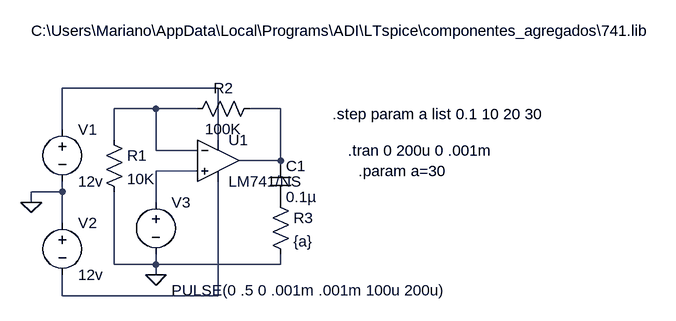
[diagram p0: schematic ej6_g2_C_sim.asc]
ej6_g2_C_sim.asc, the LTspice schematic file:
Version 4
SHEET 1 1064 680
WIRE 272 144 32 144
WIRE 176 176 112 176
WIRE 240 176 176 176
WIRE 368 176 320 176
WIRE 32 208 32 144
WIRE 112 224 112 176
WIRE 272 224 272 144
WIRE 176 240 176 176
WIRE 240 240 176 240
WIRE 368 256 368 176
WIRE 368 256 304 256
WIRE 240 272 176 272
WIRE 32 304 32 288
WIRE 32 304 -16 304
WIRE -16 320 -16 304
WIRE 176 320 176 272
WIRE 32 352 32 304
WIRE 112 416 112 304
WIRE 176 416 176 400
WIRE 176 416 112 416
WIRE 368 416 368 400
WIRE 368 416 176 416
WIRE 176 432 176 416
WIRE 32 464 32 432
WIRE 272 464 272 288
WIRE 272 464 32 464
FLAG -16 320 0
FLAG 176 432 0
SYMBOL res 96 208 R0
SYMATTR InstName R1
SYMATTR Value 10K
SYMBOL res 336 160 R90
WINDOW 0 0 56 VBottom 2
WINDOW 3 32 56 VTop 2
SYMATTR InstName R2
SYMATTR Value 100K
SYMBOL cap 352 256 R0
SYMATTR InstName C1
SYMATTR Value 0.1µ
SYMBOL voltage 32 192 R0
WINDOW 123 0 0 Left 0
WINDOW 39 0 0 Left 0
SYMATTR InstName V1
SYMATTR Value 12v
SYMBOL voltage 32 336 R0
WINDOW 123 0 0 Left 0
WINDOW 39 0 0 Left 0
SYMATTR InstName V2
SYMATTR Value 12v
SYMBOL voltage 176 304 R0
WINDOW 3 24 152 Left 2
WINDOW 123 24 124 Left 2
WINDOW 39 0 0 Left 0
SYMATTR Value PULSE(0 .5 0 .001m .001m 100u 200u)
SYMATTR InstName V3
SYMBOL res 352 304 R0
SYMATTR InstName R3
SYMATTR Value {a}
SYMBOL OpAmps\\opamp2 272 192 R0
SYMATTR InstName U1
SYMATTR Value LM741/NS
SYMATTR Prefix ""
TEXT 448 184 Left 2 !.step param a list 0.1 10 20 30
TEXT 472 240 Left 2 !.tran 0 200u 0 .001m
TEXT 488 272 Left 2 !.param a=30
TEXT -16 56 Left 2 !C:\\Users\\Mariano\\AppData\\Local\\Programs\\ADI\\LTspice\\componentes_agregados\\741.lib

The netlist it stands for:
* ej6_g2_C_sim.asc
R1 N002 0 10K
R2 N003 N002 100K
C1 N003 P001 0.1µ
V1 N001 0 12v
V2 0 N005 12v
V3 N004 0 PULSE(0 .5 0 .001m .001m 100u 200u)
R3 P001 0 {a}
XU1 N004 N002 N001 N005 N003 LM741/NS  ; pins In+ In- V+ V- OUT
.step param a list 0.1 10 20 30
.tran 0 200u 0 .001m
.param a=30
C:\Users\Mariano\AppData\Local\Programs\ADI\LTspice\componentes_agregados\741.lib
.backanno
.end